# EAGLE design Tannenbaum (EAGLE 9.2.0)
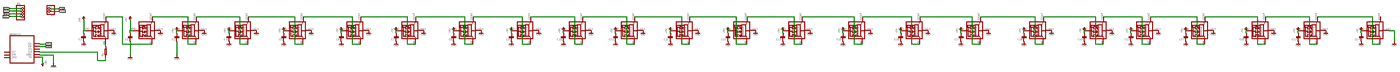
[diagram p0: schematic, sheet 1, overview]
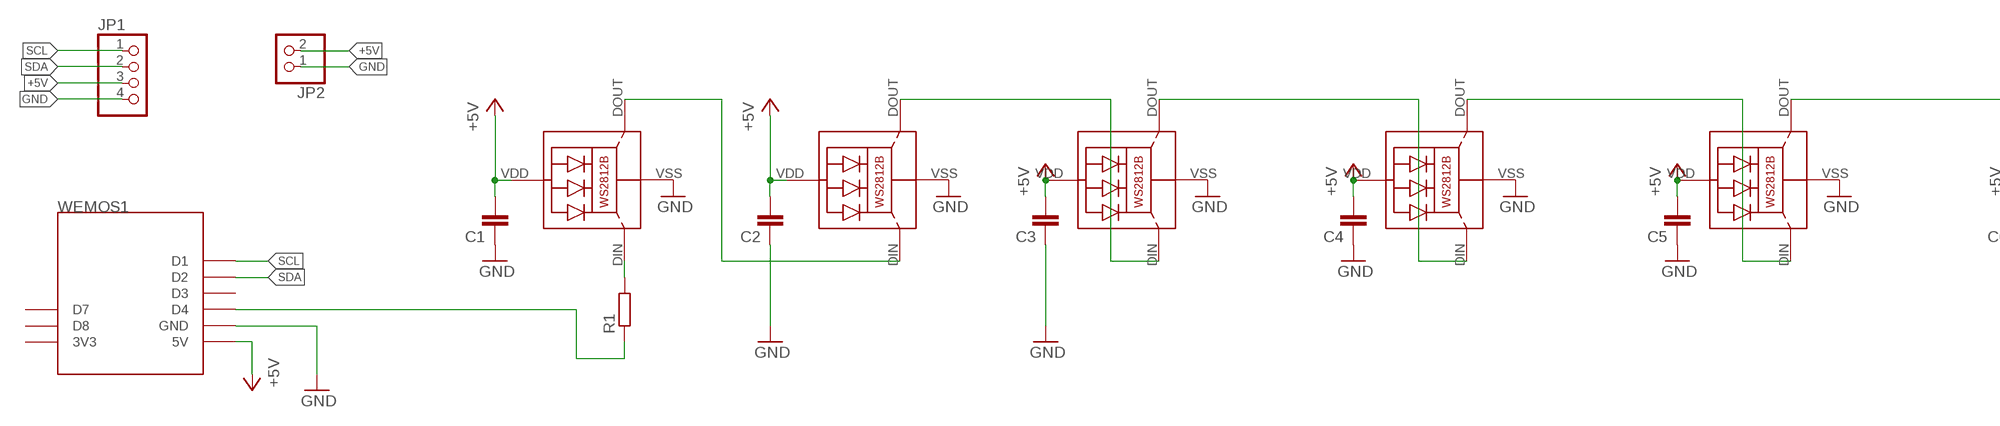
[diagram p1: schematic, sheet 1, part 1 of 4]
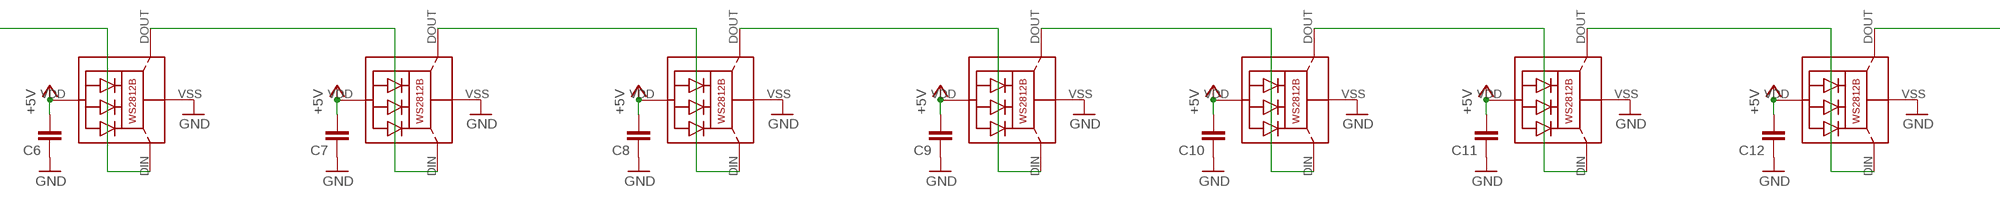
[diagram p2: schematic, sheet 1, part 2 of 4]
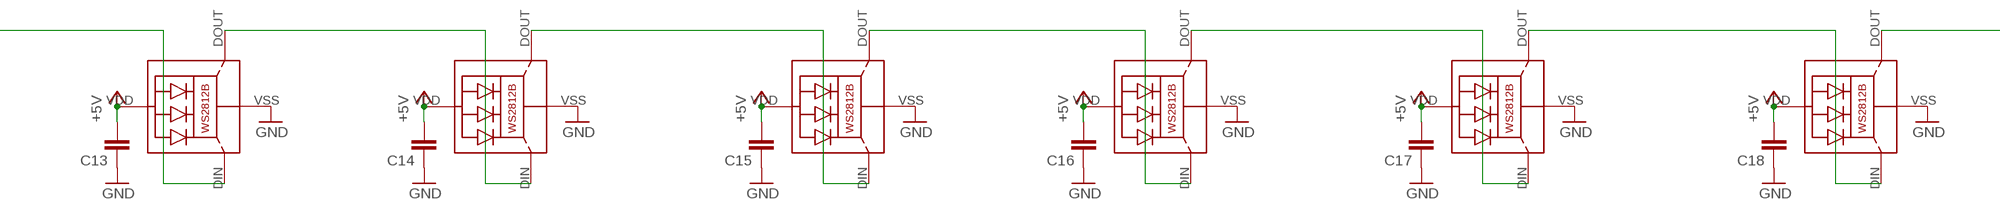
[diagram p3: schematic, sheet 1, part 3 of 4]
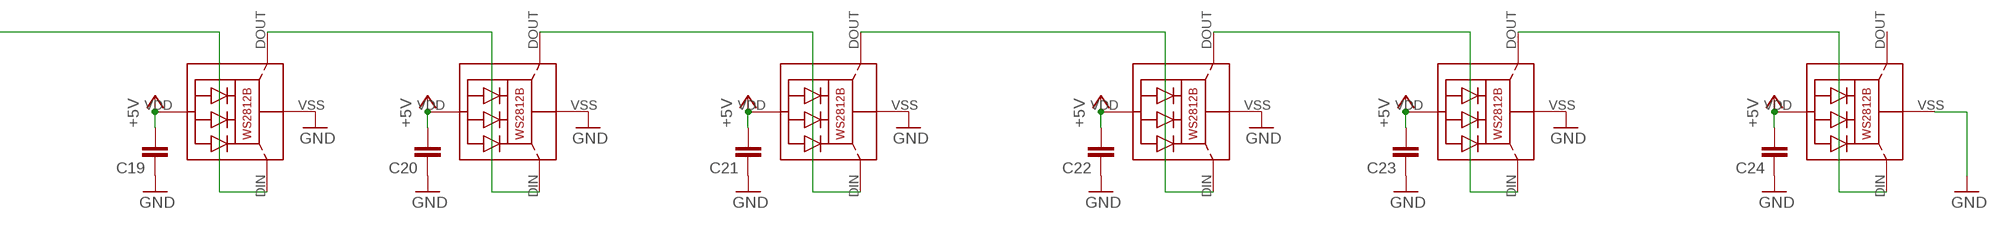
[diagram p4: schematic, sheet 1, part 4 of 4]

## Parts
C1  C-EUC0805  [C0805]
C2  C-EUC0805  [C0805]
C3  C-EUC0805  [C0805]
C4  C-EUC0805  [C0805]
C5  C-EUC0805  [C0805]
C6  C-EUC0805  [C0805]
C7  C-EUC0805  [C0805]
C8  C-EUC0805  [C0805]
C9  C-EUC0805  [C0805]
C10  C-EUC0805  [C0805]
C11  C-EUC0805  [C0805]
C12  C-EUC0805  [C0805]
C13  C-EUC0805  [C0805]
C14  C-EUC0805  [C0805]
C15  C-EUC0805  [C0805]
C16  C-EUC0805  [C0805]
C17  C-EUC0805  [C0805]
C18  C-EUC0805  [C0805]
C19  C-EUC0805  [C0805]
C20  C-EUC0805  [C0805]
C21  C-EUC0805  [C0805]
C22  C-EUC0805  [C0805]
C23  C-EUC0805  [C0805]
C24  C-EUC0805  [C0805]
JP1  PINHD-1X4  [1X04]
JP2  PINHD-1X2  [1X02]
LED1  WS2812B  [WS2812B]
LED2  WS2812B  [WS2812B]
LED3  WS2812B  [WS2812B]
LED4  WS2812B  [WS2812B]
LED5  WS2812B  [WS2812B]
LED6  WS2812B  [WS2812B]
LED7  WS2812B  [WS2812B]
LED8  WS2812B  [WS2812B]
LED9  WS2812B  [WS2812B]
LED10  WS2812B  [WS2812B]
LED11  WS2812B  [WS2812B]
LED12  WS2812B  [WS2812B]
LED13  WS2812B  [WS2812B]
LED14  WS2812B  [WS2812B]
LED15  WS2812B  [WS2812B]
LED16  WS2812B  [WS2812B]
LED17  WS2812B  [WS2812B]
LED18  WS2812B  [WS2812B]
LED19  WS2812B  [WS2812B]
LED20  WS2812B  [WS2812B]
LED21  WS2812B  [WS2812B]
LED22  WS2812B  [WS2812B]
LED23  WS2812B  [WS2812B]
LED24  WS2812B  [WS2812B]
R1  R-EU_R0805  [R0805]
WEMOS1  WEMOS-D1-MINI1  [WEMOS-D1-MINI1]

## Nets
+5V: C1.2 C2.2 C3.2 C4.2 C5.2 C6.2 C7.2 C8.2 C9.2 C10.2 C11.2 C12.2 C13.2 C14.2 C15.2 C16.2 C17.2 C18.2 C19.2 C20.2 C21.2 C22.2 C23.2 C24.2 JP1.3 JP2.2 LED1.VDD LED2.VDD LED3.VDD LED4.VDD LED5.VDD LED6.VDD LED7.VDD LED8.VDD LED9.VDD LED10.VDD LED11.VDD LED12.VDD LED13.VDD LED14.VDD LED15.VDD LED16.VDD LED17.VDD LED18.VDD LED19.VDD LED20.VDD LED21.VDD LED22.VDD LED23.VDD LED24.VDD WEMOS1.5V
GND: C1.1 C2.1 C3.1 C4.1 C5.1 C6.1 C7.1 C8.1 C9.1 C10.1 C11.1 C12.1 C13.1 C14.1 C15.1 C16.1 C17.1 C18.1 C19.1 C20.1 C21.1 C22.1 C23.1 C24.1 JP1.4 JP2.1 LED1.VSS(GND) LED2.VSS(GND) LED3.VSS(GND) LED4.VSS(GND) LED5.VSS(GND) LED6.VSS(GND) LED7.VSS(GND) LED8.VSS(GND) LED9.VSS(GND) LED10.VSS(GND) LED11.VSS(GND) LED12.VSS(GND) LED13.VSS(GND) LED14.VSS(GND) LED15.VSS(GND) LED16.VSS(GND) LED17.VSS(GND) LED18.VSS(GND) LED19.VSS(GND) LED20.VSS(GND) LED21.VSS(GND) LED22.VSS(GND) LED23.VSS(GND) LED24.VSS(GND) WEMOS1.GND
N$19: LED1.DIN(DI) R1.2
N$25: R1.1 WEMOS1.D4
N$27: LED1.DOUT(DO) LED2.DIN(DI)
N$28: LED2.DOUT(DO) LED3.DIN(DI)
N$29: LED3.DOUT(DO) LED4.DIN(DI)
N$30: LED4.DOUT(DO) LED5.DIN(DI)
N$31: LED5.DOUT(DO) LED6.DIN(DI)
N$32: LED6.DOUT(DO) LED7.DIN(DI)
N$33: LED7.DOUT(DO) LED8.DIN(DI)
N$34: LED8.DOUT(DO) LED9.DIN(DI)
N$35: LED9.DOUT(DO) LED10.DIN(DI)
N$36: LED10.DOUT(DO) LED11.DIN(DI)
N$37: LED11.DOUT(DO) LED12.DIN(DI)
N$38: LED12.DOUT(DO) LED13.DIN(DI)
N$39: LED13.DOUT(DO) LED14.DIN(DI)
N$40: LED14.DOUT(DO) LED15.DIN(DI)
N$41: LED15.DOUT(DO) LED16.DIN(DI)
N$42: LED16.DOUT(DO) LED17.DIN(DI)
N$43: LED17.DOUT(DO) LED18.DIN(DI)
N$44: LED18.DOUT(DO) LED19.DIN(DI)
N$45: LED19.DOUT(DO) LED20.DIN(DI)
N$46: LED20.DOUT(DO) LED21.DIN(DI)
N$47: LED21.DOUT(DO) LED22.DIN(DI)
N$48: LED22.DOUT(DO) LED23.DIN(DI)
N$49: LED23.DOUT(DO) LED24.DIN(DI)
SCL: JP1.1 WEMOS1.D1
SDA: JP1.2 WEMOS1.D2
Unconnected: LED24.DOUT(DO) WEMOS1.3V3 WEMOS1.D3 WEMOS1.D7 WEMOS1.D8

## Library data of the parts
C1-C24 = rcl:C-EU: CAPACITOR, European symbol; SPICEPREFIX: C
JP1 = pinhead:PINHD-1X4: PIN HEADER
JP2 = pinhead:PINHD-1X2: PIN HEADER
LED1-LED24 = WS2812B:WS2812B: Features and Benefits  * Intelligent reverse connect protection, the power supply reverse connection does not damage the IC. * The control circuit and the LED share the only power source. Control circuit and RGB chip are integrated in a package of 5050 components, form a complete control of pixel point.  * Built-in signal reshaping circuit, after wave reshaping to the next driver, ensure wave-form distortion not accumulate.  * Built-in electric reset circuit and power lost reset circuit.  * Each pixel of the three primary color can achieve 256 brightness display, completed 16777216 color full color display, and scan frequency not less than 400Hz/s.  * Cascading port transmission signal by single line.  * Any two point the distance more than 5m transmission signal without any increase circuit.  * When the refresh rate is 30fps, cascade number are not less than1024 points.  * Send data at speeds of 800Kbps.  *The color of the light were highly consistent, cost-effective. Applications  Full-color module, Full color soft lights a lamp strip. LED decorative lighting, Indoor/outdoor LED video irregular screen. General description WS2812B is a intelligent control LED light source that the control circuit and RGB chip are integrated in a package of 5050 components. It internal include intelligent digital port data latch and signal reshaping amplification drive circuit. Also include a precision internal oscillator and a 12V voltage programmable constant curre-nt control part, effectively ensuring the pixel point light color height consistent. The data transfer protocol use single NZR communication mode. After the pixel power-on reset, the DIN port receive data from controller, the first pixel collect initial 24bit data then sent to the internal data latch, the other data which reshaping by the internal signal reshaping amplification circuit sent to the next cascade pixel through the DO port. After transmission for each pixel,the signal to reduce 24bit. pixel adopt auto reshaping transmit technology, making the pixel cascade number is not limited the signal transmission, only depend on the speed of signal transmission. LED with low driving voltage, environmental protection and energy saving, high brightness, scattering angle is large, good consistency, low power, long life and other advantages. The control chip integrated in LED above becoming more simple circuit, small volume, convenient installation. Absolute Maximum Ratings Power supply voltage: VDD +3.5V..+5.3V Input voltage: VI -0.5V..VDD+0.5V based on WS2812 from https://github.com/adafruit/Adafruit-Eagle-Library
R1 = rcl:R-EU_: RESISTOR, European symbol; SPICEPREFIX: R
WEMOS1 = esp8266modules:WEMOS-D1-MINI1: WeMos.cc D1 mini ESP8266 module; SPICEPREFIX: X

## Board
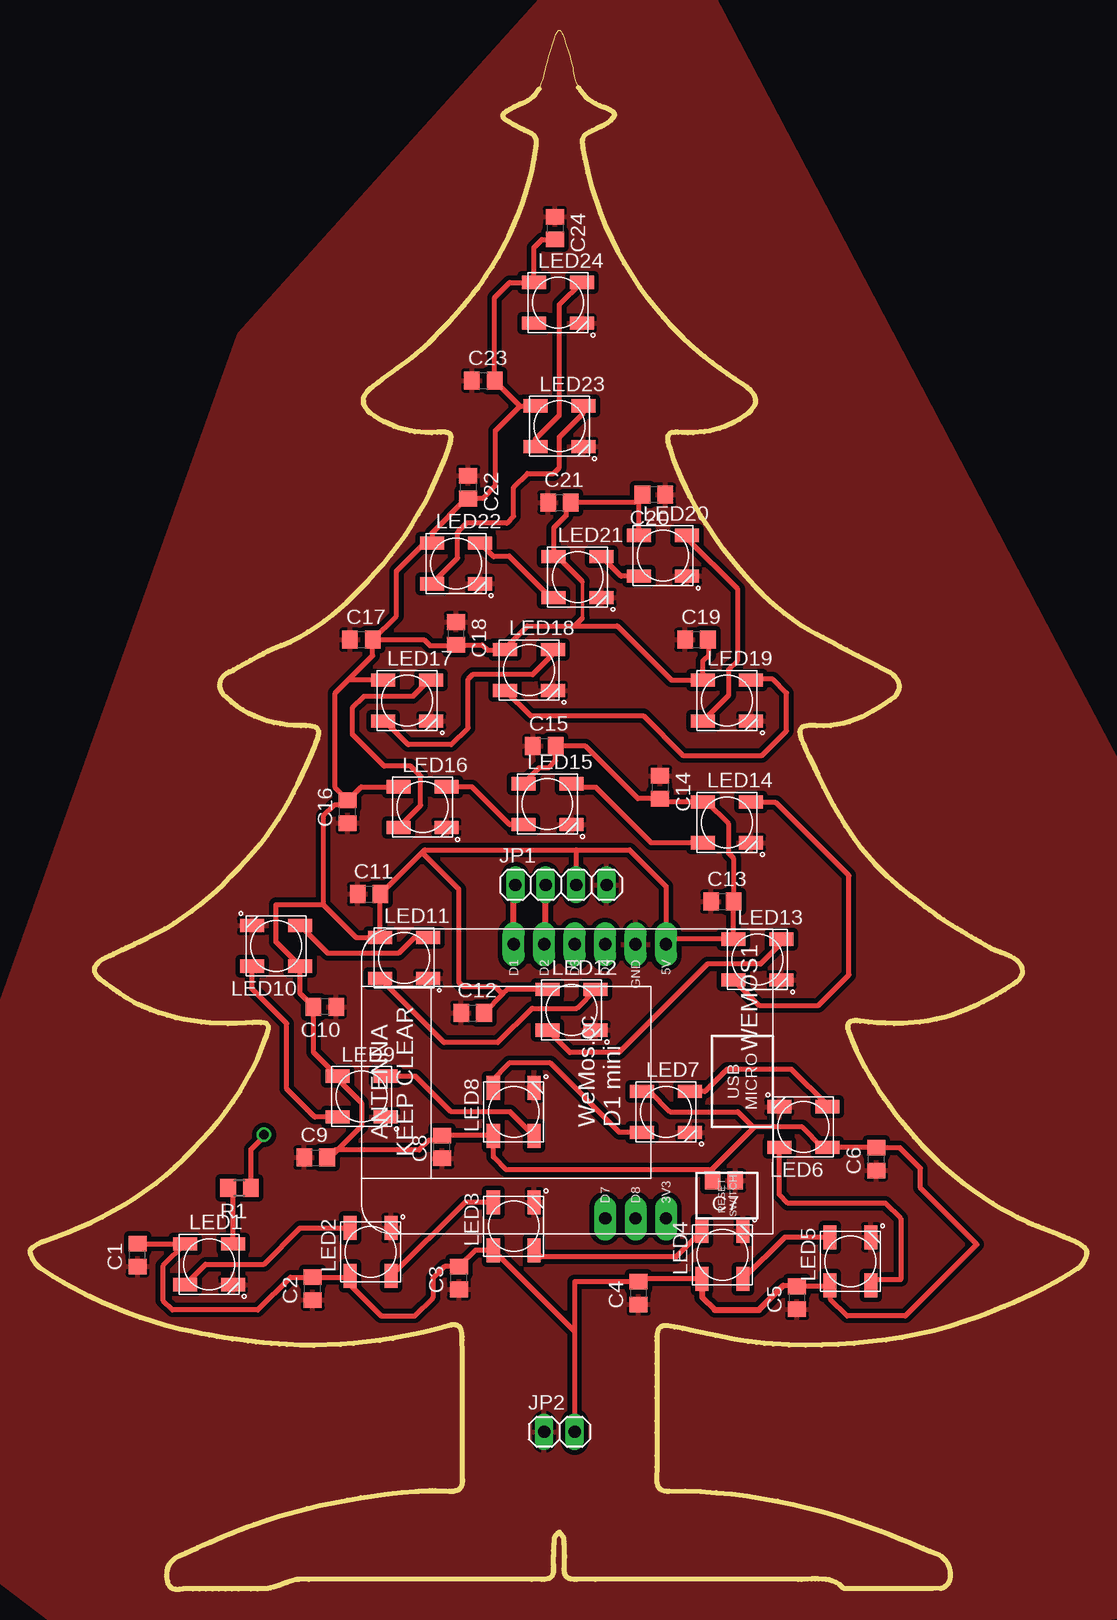
[diagram p5: board, top side]
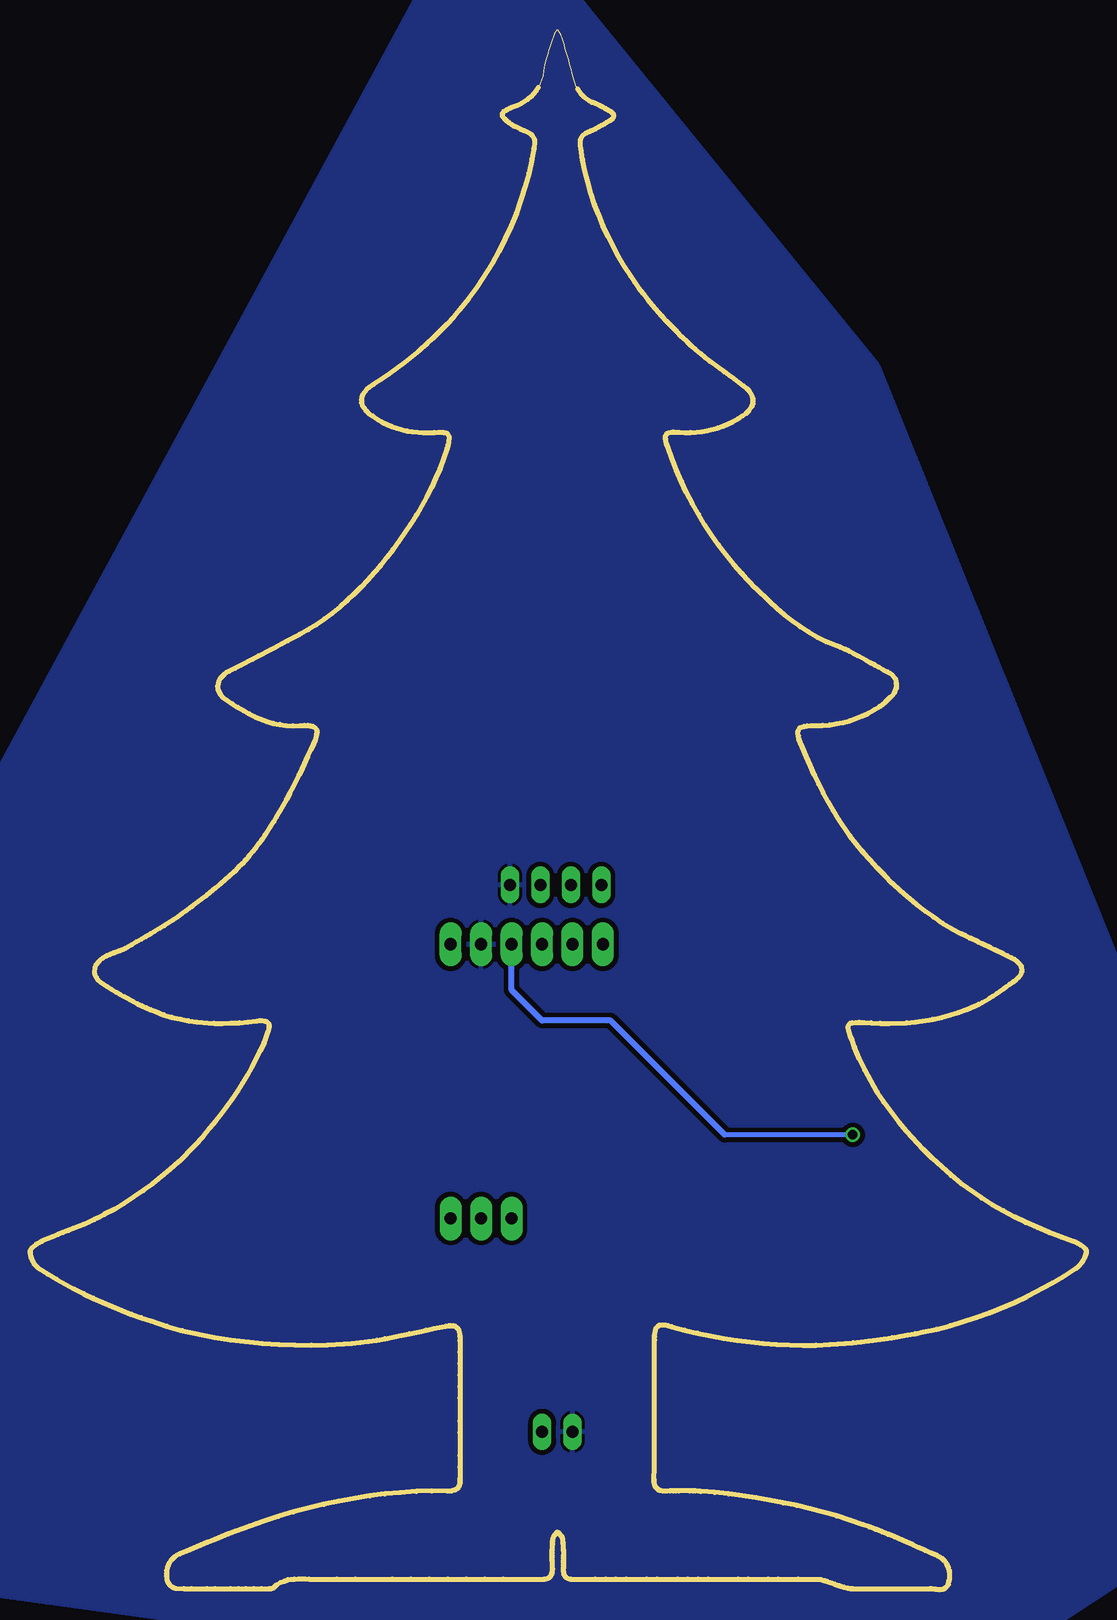
[diagram p6: board, bottom side, seen from below]

Size 88.1 x 130 mm. Coordinates in mm from the lower left corner, seen from the top.
Outline: 19.35,45.23 19.56,45.76 19.71,46.15 19.8,46.45 19.88,46.74 19.89,46.94 19.81,47.07 19.73,47.19 19.55,47.25 19.25,47.27 18.96,47.28 18.54,47.26 17.99,47.23 17.24,47.19 16.49,47.18 15.01,47.24 14.28,47.31 12.83,47.53 12.11,47.68 11.41,47.88 10.7,48.09 10,48.34 9.32,48.64 9.01,48.78 8.71,48.94 8.11,49.28 7.82,49.46 7.54,49.65 7.25,49.85 6.97,50.05 6.69,50.25 6.42,50.46 6.14,50.67 5.87,50.87 5.68,51.02 5.55,51.18 5.47,51.33 5.4,51.48 5.38,51.64 5.41,51.79 5.45,51.95 5.54,52.1 5.69,52.24 5.83,52.39 6.03,52.52 6.28,52.65 6.62,52.82 6.97,52.99 7.66,53.32 8.01,53.49 8.71,53.81 9.06,53.98 9.75,54.31 10.1,54.48 10.44,54.66 11.25,55.07 12.02,55.54 12.75,56.04 13.49,56.55 14.19,57.09 15.54,58.25 16.19,58.86 16.81,59.5 17.44,60.14 18.05,60.8 18.65,61.49 19.22,62.14 19.74,62.82 20.7,64.21 21.14,64.93 21.55,65.66 21.96,66.39 22.34,67.14 22.69,67.91 23.05,68.67 23.39,69.44 23.71,70.23 23.87,70.61 23.98,70.91 24.03,71.15 24.09,71.39 24.08,71.56 23.92,71.81 23.77,71.89 23.54,71.94 23.31,71.99 23,72.01 22.6,72.02 22,72.03 21.43,72.08 20.87,72.17 20.31,72.27 19.77,72.41 18.73,72.79 18.23,73.03 17.74,73.33 17.26,73.62 16.8,73.97 16.35,74.38 16.16,74.56 16.03,74.75 15.86,75.14 15.83,75.34 15.85,75.53 15.87,75.72 15.95,75.9 16.2,76.23 16.38,76.37 16.6,76.48 16.96,76.66 17.32,76.86 17.68,77.05 18.04,77.25 18.39,77.45 19.1,77.84 19.46,78.03 19.82,78.21 20.19,78.39 20.56,78.56 20.93,78.7 21.73,79.02 22.48,79.39 23.18,79.82 23.89,80.25 24.56,80.73 25.19,81.25 25.83,81.77 26.43,82.32 27.61,83.48 28.17,84.08 28.73,84.69 29.43,85.46 30.08,86.25 30.69,87.08 31.29,87.9 31.85,88.76 32.37,89.64 32.88,90.52 33.35,91.43 33.78,92.36 34.21,93.29 34.59,94.25 34.92,95.24 35.02,95.52 35.08,95.74 35.1,95.91 35.12,96.09 35.1,96.21 35.03,96.3 34.95,96.39 34.83,96.44 34.66,96.46 34.48,96.48 34.25,96.48 33.96,96.46 33.48,96.43 33.01,96.44 32.1,96.52 31.65,96.6 30.77,96.82 30.34,96.97 29.5,97.35 29.09,97.57 28.69,97.84 28.41,98.03 28.19,98.23 27.9,98.63 27.82,98.84 27.82,99.05 27.81,99.26 27.87,99.47 28.14,99.9 28.34,100.11 28.61,100.32 29.01,100.62 29.41,100.92 29.81,101.21 30.22,101.5 30.62,101.79 31.42,102.39 31.82,102.69 32.2,103 32.58,103.32 32.95,103.64 33.3,103.99 33.73,104.41 34.16,104.84 34.57,105.27 34.99,105.71 35.4,106.15 36.2,107.06 36.58,107.53 36.95,108 37.32,108.48 37.67,108.96 38,109.46 38.53,110.27 39.03,111.1 39.92,112.8 40.32,113.67 40.68,114.56 41.03,115.46 41.33,116.37 41.58,117.3 41.84,118.24 42.04,119.19 42.18,120.16 42.21,120.33 42.22,120.48 42.21,120.62 42.21,120.76 42.19,120.88 42.1,121.09 42.03,121.19 41.83,121.36 41.7,121.44 41.53,121.5 41.38,121.57 41.23,121.64 40.93,121.78 40.78,121.86 40.63,121.94 40.48,122.02 40.33,122.1 40.19,122.19 40.04,122.27 39.9,122.36 39.76,122.44 39.65,122.51 39.56,122.57 39.51,122.64 39.46,122.71 39.43,122.78 39.43,122.85 39.43,122.92 39.46,122.99 39.52,123.05 39.58,123.12 39.67,123.19 39.79,123.25 39.88,123.3 39.98,123.36 40.07,123.41 40.17,123.47 40.26,123.52 40.36,123.58 40.46,123.63 40.55,123.68 40.65,123.73 40.75,123.78 40.85,123.82 40.95,123.85 41.25,123.96 41.51,124.11 41.95,124.45 42.14,124.64 42.29,124.86 42.44,125.08 42.56,125.33 42.66,125.59 42.77,125.85 42.85,126.13 42.91,126.42 42.97,126.68 43.04,126.94 43.11,127.2 43.18,127.46 43.25,127.72 43.32,127.98 43.4,128.24 43.48,128.49 43.55,128.75 43.63,129.01 43.71,129.27 43.83,129.62 43.98,129.86 44.06,129.96 44.19,130 44.26,129.89 44.35,129.75 44.43,129.6 44.51,129.37 44.54,129.26 44.62,129.02 44.78,128.54 44.86,128.3 44.93,128.06 45.01,127.82 45.08,127.58 45.2,127.09 45.25,126.85 45.29,126.6 45.35,126.2 45.44,125.85 45.58,125.53 45.72,125.21 45.9,124.93 46.11,124.69 46.33,124.44 46.58,124.23 47.16,123.86 47.49,123.71 47.85,123.58 47.91,123.56 47.97,123.53 48.04,123.5 48.1,123.48 48.16,123.45 48.22,123.41 48.27,123.38 48.33,123.35 48.45,123.28 48.51,123.25 48.57,123.21 48.61,123.18 48.65,123.14 48.7,123.05 48.72,123 48.72,122.95 48.73,122.9 48.72,122.85 48.68,122.75 48.64,122.71 48.6,122.67 48.58,122.64 48.49,122.55 48.42,122.48 48.34,122.41 48.26,122.34 48.16,122.26 47.93,122.11 47.81,122.04 47.68,121.97 47.23,121.77 46.89,121.62 46.64,121.48 46.39,121.34 46.23,121.22 46.05,120.89 46.03,120.69 46.09,120.12 46.16,119.75 46.27,119.25 46.51,118.08 46.82,116.94 47.56,114.73 47.99,113.65 48.49,112.61 48.99,111.56 49.56,110.55 50.82,108.57 51.52,107.61 52.28,106.68 52.79,106.06 53.33,105.47 54.45,104.34 55.04,103.8 55.64,103.29 56.24,102.78 56.86,102.29 57.5,101.82 58.13,101.35 58.79,100.9 59.45,100.46 59.78,100.24 60.03,100.03 60.36,99.59 60.45,99.37 60.46,99.15 60.47,98.93 60.4,98.71 60.24,98.48 60.09,98.26 59.85,98.04 59.53,97.82 59.15,97.55 58.75,97.32 57.93,96.95 57.51,96.8 56.65,96.58 56.21,96.51 55.31,96.43 54.85,96.43 54.38,96.46 54.06,96.48 53.81,96.48 53.62,96.45 53.44,96.42 53.31,96.36 53.17,96.16 53.15,96.02 53.19,95.65 53.25,95.41 53.34,95.11 53.61,94.27 53.92,93.45 54.27,92.65 54.63,91.85 55.02,91.08 55.87,89.57 56.34,88.83 57.31,87.4 57.83,86.7 58.37,86.01 58.88,85.37 59.4,84.75 59.95,84.15 60.49,83.55 61.06,82.98 61.66,82.44 62.26,81.89 62.89,81.38 63.55,80.91 64.21,80.43 64.9,80 65.63,79.61 66.12,79.36 66.61,79.1 67.09,78.84 67.58,78.58 68.06,78.33 69.04,77.81 69.53,77.56 70.5,77.05 70.99,76.8 71.49,76.56 71.71,76.44 71.92,76.29 72.08,76.11 72.25,75.93 72.37,75.73 72.47,75.3 72.45,75.07 72.23,74.6 72.02,74.37 71.7,74.14 71.24,73.82 70.77,73.52 70.3,73.25 69.82,72.98 69.33,72.74 68.33,72.35 67.81,72.2 67.27,72.11 66.73,72.02 66.17,71.98 65.58,72.02 65.23,72.04 64.95,72.03 64.74,72 64.52,71.96 64.37,71.89 64.2,71.66 64.18,71.5 64.21,71.3 64.24,71.09 64.33,70.83 64.47,70.51 64.7,69.99 64.93,69.47 65.42,68.43 65.67,67.91 66.18,66.89 66.44,66.38 66.72,65.87 66.99,65.37 67.27,64.87 67.56,64.38 67.79,64.01 68.02,63.63 68.5,62.9 68.76,62.54 69.02,62.18 69.29,61.83 69.56,61.49 69.85,61.15 70.13,60.82 70.43,60.5 70.73,60.19 71.09,59.83 71.46,59.48 71.83,59.15 72.21,58.81 72.6,58.49 73.39,57.85 73.79,57.54 74.6,56.93 75.01,56.64 75.42,56.34 75.78,56.08 76.15,55.83 76.9,55.35 77.28,55.11 77.67,54.88 78.05,54.65 78.44,54.43 78.82,54.21 79.21,53.98 79.6,53.76 79.99,53.54 80.12,53.46 80.26,53.39 80.41,53.33 80.56,53.27 80.71,53.21 80.86,53.16 81.01,53.1 81.16,53.05 81.31,52.99 81.45,52.93 81.6,52.87 81.74,52.8 82.03,52.64 82.26,52.46 82.43,52.27 82.59,52.08 82.69,51.87 82.73,51.45 82.68,51.24 82.56,51.03 82.44,50.83 82.24,50.63 81.97,50.45 81.62,50.24 81.28,50.02 80.92,49.81 80.57,49.6 80.21,49.4 79.49,49.02 79.12,48.83 78.75,48.66 78.38,48.49 78.01,48.33 77.63,48.18 76.95,47.91 76.27,47.71 75.57,47.56 74.88,47.4 74.18,47.3 72.77,47.2 72.06,47.18 71.35,47.21 70.63,47.24 69.92,47.3 69.2,47.39 68.96,47.42 68.76,47.42 68.46,47.37 68.34,47.32 68.2,47.15 68.17,47.03 68.18,46.88 68.18,46.74 68.23,46.55 68.32,46.34 68.6,45.61 68.91,44.91 69.61,43.54 69.98,42.87 70.38,42.21 70.79,41.56 71.22,40.93 71.67,40.3 72.12,39.68 72.6,39.07 73.1,38.47 73.72,37.72 74.37,37.01 75.72,35.66 76.42,35.02 77.89,33.82 78.65,33.25 80.23,32.2 81.05,31.7 81.9,31.25 82.31,31.03 82.73,30.83 83.16,30.65 83.59,30.46 84.03,30.28 84.46,30.11 84.9,29.93 85.34,29.76 85.77,29.59 86.21,29.41 86.64,29.23 87.07,29.04 87.18,29 87.29,28.94 87.52,28.8 87.64,28.72 87.85,28.56 87.93,28.47 88.06,28.3 88.1,28.22 88.1,28.15 88.1,28.03 88.08,27.9 88,27.64 87.95,27.5 87.88,27.38 87.81,27.25 87.73,27.13 87.64,27.02 87.56,26.92 87.46,26.83 87.36,26.77 86.63,26.3 85.89,25.86 84.37,25.04 83.6,24.65 82.82,24.29 82.04,23.92 81.25,23.59 79.64,22.95 78.83,22.66 78,22.38 76.69,21.94 75.38,21.58 72.72,21.01 71.39,20.8 68.71,20.5 67.36,20.42 66.01,20.39 64.66,20.37 63.3,20.4 61.94,20.47 61.25,20.51 60.57,20.59 59.88,20.69 59.2,20.79 58.51,20.91 57.15,21.18 56.46,21.33 55.1,21.62 54.42,21.76 53.74,21.89 53.44,21.95 53.19,21.98 53,21.98 52.81,21.98 52.66,21.95 52.55,21.87 52.44,21.79 52.37,21.66 52.33,21.48 52.28,21.3 52.26,21.07 52.26,20.76 52.26,19.8 52.26,18.85 52.26,17.89 52.26,16.93 52.26,15.97 52.26,14.06 52.26,13.1 52.26,11.18 52.25,10.23 52.25,9.27 52.25,9.08 52.26,8.91 52.33,8.64 52.39,8.53 52.55,8.36 52.65,8.29 52.93,8.21 53.09,8.2 53.29,8.2 54.61,8.22 55.91,8.17 57.21,8.07 58.5,7.96 59.79,7.8 62.34,7.37 63.61,7.1 66.13,6.46 67.38,6.1 68.62,5.69 69.21,5.5 69.8,5.29 70.97,4.86 71.56,4.63 72.72,4.16 73.3,3.93 73.87,3.69 74.45,3.45 75.03,3.21 75.61,2.97 75.83,2.87 76.03,2.74 76.19,2.58 76.35,2.42 76.48,2.22 76.66,1.8 76.71,1.58 76.72,1.34 76.72,1.1 76.69,0.86 76.61,0.62 76.59,0.56 76.55,0.5 76.5,0.44 76.46,0.38 76.39,0.32 76.33,0.27 76.26,0.22 76.19,0.17 76.12,0.14 76.05,0.11 75.98,0.09 75.92,0.09 75.27,0.08 74.62,0.08 73.33,0.07 72.68,0.07 71.39,0.06 70.74,0.07 70.1,0.07 69.45,0.07 68.8,0.07 68.16,0.07 68.12,0.07 68.09,0.07 68.05,0.07 68.02,0.07 67.98,0.08 67.94,0.08 67.91,0.09 67.88,0.1 67.85,0.11 67.82,0.12 67.79,0.13 67.77,0.15 67.5,0.42 67.21,0.59 66.9,0.71 66.6,0.82 66.37,0.85 66.05,0.87 65.73,0.89 65.48,0.89 65.15,0.88 64.83,0.86 64.35,0.85 64.03,0.85 62.5,0.86 60.96,0.86 57.89,0.87 56.35,0.87 54.81,0.87 53.27,0.87 51.74,0.87 50.2,0.86 48.66,0.86 47.13,0.85 45.59,0.84 45.38,0.84 45.21,0.86 45.07,0.89 44.94,0.93 44.83,0.99 44.75,1.07 44.66,1.15 44.61,1.26 44.58,1.39 44.55,1.53 44.54,1.69 44.54,1.88 44.55,2.07 44.56,2.27 44.56,2.46 44.56,2.65 44.56,2.84 44.56,3.04 44.56,3.23 44.55,3.42 44.55,3.62 44.54,3.81 44.53,4 44.51,4.19 44.51,4.25 44.49,4.3 44.44,4.4 44.4,4.46 44.36,4.51 44.32,4.56 44.28,4.61 44.2,4.71 44.16,4.76 44.12,4.81 44.09,4.77 44.04,4.72 44,4.67 43.95,4.63 43.91,4.58 43.87,4.53 43.82,4.49 43.79,4.44 43.73,4.34 43.71,4.3 43.71,4.25 43.69,4.05 43.67,3.85 43.66,3.64 43.65,3.44 43.64,3.24 43.63,2.84 43.62,2.64 43.62,2.44 43.62,2.24 43.63,2.03 43.64,1.83 43.64,1.65 43.64,1.5 43.61,1.37 43.58,1.24 43.53,1.14 43.39,0.98 43.29,0.93 43.03,0.86 42.87,0.84 42.67,0.84 41.82,0.85 40.96,0.86 40.1,0.86 39.25,0.87 38.39,0.87 36.68,0.87 35.82,0.87 34.11,0.86 33.25,0.86 32.39,0.86 31.56,0.86 29.07,0.87 28.23,0.87 26.57,0.87 25.74,0.87 24.08,0.86 23.25,0.85 22.41,0.84 22.27,0.84 22.14,0.82 21.86,0.75 21.72,0.7 21.58,0.65 21.44,0.6 21.31,0.55 21.03,0.44 20.89,0.39 20.75,0.35 20.65,0.32 20.54,0.29 20.44,0.26 20.34,0.23 20.23,0.2 20.03,0.14 19.92,0.12 19.82,0.1 19.71,0.08 19.61,0.07 19.51,0.07 18.97,0.06 18.43,0.06 17.36,0.05 16.82,0.04 16.28,0.04 15.74,0.04 15.21,0.05 14.67,0.05 14.13,0.05 13.59,0.06 13.06,0.07 12.92,0.08 12.76,0.05 12.6,0.03 12.45,0.02 12.29,0 12.14,0.01 11.99,0.03 11.85,0.07 11.74,0.17 11.63,0.27 11.54,0.43 11.48,0.68 11.43,0.91 11.42,1.14 11.43,1.35 11.45,1.56 11.5,1.77 11.66,2.13 11.77,2.3 11.92,2.44 12.06,2.58 12.24,2.71 12.45,2.8 12.96,3.03 13.47,3.27 13.98,3.5 14.49,3.72 15,3.95 16.04,4.39 16.56,4.6 17.08,4.81 17.6,5.01 18.12,5.21 18.65,5.4 19.74,5.78 20.84,6.13 23.06,6.74 24.18,7 25.31,7.23 26.44,7.46 27.58,7.65 29.86,7.96 31.01,8.08 32.16,8.18 32.4,8.2 32.63,8.21 32.86,8.22 33.1,8.23 33.33,8.23 33.56,8.23 33.79,8.23 34.03,8.23 34.26,8.22 34.49,8.22 34.73,8.21 34.96,8.2 35.15,8.19 35.32,8.2 35.46,8.23 35.6,8.26 35.71,8.31 35.89,8.46 35.96,8.56 36,8.69 36.04,8.82 36.06,8.98 36.06,9.18 36.06,10.15 36.05,11.11 36.05,12.08 36.05,13.04 36.05,16.91 36.05,17.87 36.05,18.84 36.04,19.81 36.04,20.77 36.03,21.09 36.02,21.34 35.97,21.53 35.93,21.72 35.86,21.85 35.75,21.94 35.64,22.02 35.5,22.06 35.12,22.04 34.88,22 34.58,21.91 33.51,21.62 32.42,21.36 30.25,20.93 29.16,20.76 26.96,20.5 25.86,20.42 23.65,20.35 22.54,20.36 21.43,20.43 20.78,20.47 20.13,20.52 19.48,20.58 18.82,20.64 18.17,20.72 16.88,20.89 16.23,20.99 15.58,21.1 14.94,21.21 14.3,21.33 13.66,21.46 12.52,21.7 11.39,21.99 9.19,22.67 8.1,23.06 5.98,23.95 4.94,24.44 2.89,25.53 1.89,26.12 0.91,26.76 0.8,26.83 0.7,26.92 0.6,27.03 0.5,27.13 0.41,27.25 0.33,27.38 0.25,27.51 0.18,27.64 0.07,27.91 0.03,28.04 0.01,28.17 0,28.23 0.04,28.3 0.11,28.38 0.18,28.46 0.28,28.55 0.51,28.71 0.65,28.8 0.78,28.87 0.91,28.94 1.04,29 1.15,29.04 2.16,29.38 3.15,29.76 4.12,30.18 5.09,30.6 6.04,31.06 6.95,31.57 7.87,32.07 8.76,32.63 10.48,33.85 11.31,34.51 12.1,35.24 12.86,35.95 13.61,36.68 15.01,38.2 15.68,38.99 16.3,39.81 16.92,40.64 17.49,41.49 18.51,43.3 18.97,44.24 19.35,45.23
Copper layers (1*16): Top 0.035mm / dielectric 1.5mm / Bottom 0.035mm
Design rules "default *": minimum track width 6mil, minimum drill 0.35mm, track to track 0.4mm, track to pad 0.4mm, pad to pad 0.4mm, via to via 0.4mm, smd to smd 0.4mm, copper to edge 0mil, drill to drill 0.6mm, minimum pad ring 10mil, minimum via ring 8mil, stop-mask expansion 4mil, vias tented up to drill 0mil, thermal gap 10mil

### Footprints (pad centres in the part's own frame; a part is rotated, then mirrored left to right if it is on the bottom)
C0805 = smd 1.3 x 1.5: 1 -0.95,0; 2 0.95,0
1X04 = drill 1.016 long: 1 -3.81,0; 2 -1.27,0; 3 1.27,0; 4 3.81,0
1X02 = drill 1.016 long: 1 -1.27,0; 2 1.27,0
WS2812B = smd 2 x 1.1: DIN 2,1.7; DOUT -2,-1.7; VDD -2,1.7; VSS 2,-1.7
R0805 = smd 1.3 x 1.5: 1 -0.95,0; 2 0.95,0
WEMOS-D1-MINI1 = drill 1.016 pad 1.829 long: 3V3 -10.16,-10.16; 5V 12.7,-10.16; D1 12.7,2.54; D2 12.7,0; D3 12.7,-2.54; D4 12.7,-5.08; D7 -10.16,-5.08; D8 -10.16,-7.62; GND 12.7,-7.62

### Placement (x,y rotation side)
C1  8.96,27.88 90 top
C2  23.57,25.08 90 top
C3  35.76,25.97 90 top
C4  50.75,24.7 90 top
C5  63.95,24.32 90 top
C6  70.56,35.88 90 top
C7  57.86,34.1 180 top
C8  34.36,36.9 90 top
C9  23.82,36.01 0 top
C10  24.58,48.58 180 top
C11  28.27,57.98 0 top
C12  36.9,48.07 0 top
C13  57.73,57.34 0 top
C14  52.52,66.87 270 top
C15  42.87,70.3 0 top
C16  26.49,64.84 90 top
C17  27.63,79.19 0 top
C18  35.51,79.69 270 top
C19  55.57,79.19 0 top
C20  52.02,91.25 180 top
C21  44.14,90.62 0 top
C22  36.52,91.89 270 top
C23  37.79,100.78 0 top
C24  43.76,113.48 270 top
JP1  44.27,58.74 0 top
JP2  44.14,13.15 0 top
LED1  14.93,27.12 0 top
LED2  28.39,28.13 90 top
LED3  40.33,30.29 90 top
LED4  57.73,27.88 90 top
LED5  68.4,27.37 90 top
LED6  64.46,38.55 180 top
LED7  53.03,39.82 0 top
LED8  40.33,39.82 90 top
LED9  27.63,41.09 0 top
LED10  20.52,53.66 180 top
LED11  31.19,52.64 0 top
LED12  45.16,48.33 0 top
LED13  60.65,52.52 0 top
LED14  58.11,63.95 0 top
LED15  43.13,65.47 0 top
LED16  32.71,65.22 0 top
LED17  31.44,74.11 0 top
LED18  41.6,76.65 0 top
LED19  58.11,74.11 0 top
LED20  52.78,86.17 0 top
LED21  45.67,84.39 0 top
LED22  35.51,85.54 0 top
LED23  44.14,96.97 0 top
LED24  44.01,107.25 0 top
R1  17.47,33.47 180 top
WEMOS1  42.87,41.09 90 top

### Tracks (layer width: path | path; a pad name or v marks a point on that pad's centre or on a via)
+5V
  Top 0.305: 46.05,84.01 46.05,80.96
  Top 0.406: C1.2 LED1.VDD 11.08,26.96 11.08,24.11 11.88,23.31 19,23.31 21.72,26.03 C2.2 26.6,26.03 LED2.VDD 26.69,25.39 29.28,22.8 32.08,22.8 33.6,24.32 33.6,25.97 34.55,26.92 C3.2 37.13,28.29 LED3.VDD 45.41,21.51 | 45.41,21.51 45.41,25.65 C4.2 50.97,25.88 LED4.VDD | 45.41,21.51 JP2.2 | 62.81,25.34 63.89,25.34 C5.2 66.6,25.27 LED5.VDD 66.7,24.24 68.14,22.8 72.97,22.8 78.94,28.77 74.24,33.47 74.24,35.12 72.53,36.83 C6.2 70.54,36.85 LED6.VDD 66.08,36.85 64.38,38.55 60.4,38.55 | 60.4,38.55 60.27,38.55 59,39.82 53.37,39.82 51.67,41.52 LED7.VDD | 60.4,38.55 56.91,35.06 C7.2 56.91,34.86 56.78,34.99 39.7,34.99 38.63,36.06 LED8.VDD 38.6,37.85 C8.2 33.97,37.45 33.26,37.45 32.45,36.64 25.41,36.64 C9.2 25.01,36.01 27.63,38.63 27.63,40.58 25.63,42.58 LED9.VDD 23.63,44.78 C10.2 22.52,49.69 LED10.VDD 20.52,53.96 20.52,57.09 24.46,57.09 | 58.6,54.17 LED13.VDD | LED13.VDD 58.65,57.31 C13.2 58.68,60.92 58.26,61.34 58.26,63.8 56.41,65.65 LED14.VDD 52.79,65.65 C14.2 50.68,65.92 46.3,70.3 C15.2 43.82,69.09 43.25,68.52 42.47,68.52 LED15.VDD | 24.46,57.09 27.2,54.34 LED11.VDD 29.19,57.95 C11.2 32.68,61.44 | C16.2 26.09,65.39 25.38,65.39 24.46,64.46 24.46,57.09 | C16.2 27.62,66.92 LED16.VDD | C17.2 28.58,77.85 26.54,75.81 | C16.2 25.44,66.83 25.44,74.71 26.54,75.81 | LED17.VDD 26.54,75.81 | C17.2 32.84,79.19 33.35,78.68 35.44,78.68 C18.2 37.73,78.74 38.17,78.3 39.55,78.3 LED18.VDD 39.6,78.46 41.47,80.33 45.41,80.33 | 50.73,87.82 LED20.VDD 50.78,90.96 C20.2 | C19.2 56.59,79.12 56.59,77.92 56.11,77.44 LED19.VDD 53.49,75.81 48.97,80.33 45.41,80.33 | C20.2 50.43,90.62 C21.2 44.7,90.22 44.7,89.51 43.67,88.48 LED21.VDD 43.97,86.09 46.05,84.01
  Top 0.406: 45.41,80.33 46.05,80.96 | C17.2 30.55,81.16 30.55,84.9 32.89,87.24 LED22.VDD 33.51,88.08 36.37,90.94 C22.2 36.58,91 37.79,91 38.81,92.01 38.81,96.62 40.85,98.67 | 40.85,98.67 C23.2 38.74,107.7 40,108.95 LED24.VDD 42.01,111.86 42.68,112.53 C24.2 43.32,112.53 | 39.41,49.63 39.81,50.03 LED12.VDD | 39.41,49.63 C12.2 | LED13.VDD 53.46,54.22 WEMOS1.5V 53.03,58.61 49.98,61.66 45.54,61.66 | 45.54,61.66 JP1.3 | 32.68,61.44 32.9,61.66 45.54,61.66 | 39.41,49.63 38.81,50.23 36.14,50.23 35.76,50.61 35.76,58.36 32.68,61.44 | C20.2 51.13,91.31 | 40.85,98.67 LED23.VDD
  Top 0.508: LED4.VDD 56.03,24.37 57.1,23.31 60.78,23.31 62.81,25.34
GND
  pour Bottom: -18.09,10.61 14.93,-10.98 125.42,4.26 50.49,142.69 17.47,102.05 -19.36,10.61
  pour Top: -15.55,11.88 17.47,104.59 51.76,142.69 125.42,2.99 16.2,-13.52 -15.55,10.61
N$19
  Top 0.406: LED1.DIN 16.93,32.35 16.92,32.36 16.92,33.07 R1.2
N$25  (via drill 0.8)
  Top 0.406: R1.1 18.42,36.7 19.5,37.78 v19.5,37.91
  Bottom 0.406: v19.5,37.91 30.17,37.91
  Bottom 0.508: 30.17,37.91 39.7,47.44 45.41,47.44 47.95,49.98 WEMOS1.D4
N$27
  Top 0.406: 13.23,25.42 LED1.DOUT 14.63,27.12 19.5,27.12 22.52,30.13 LED2.DIN
N$28
  Top 0.406: LED2.DOUT 36.25,32.29 LED3.DIN
N$29
  Top 0.406: LED4.DIN 53.87,27.72 42.6,27.72 LED3.DOUT
N$30
  Top 0.406: LED4.DOUT 62.92,29.37 LED5.DIN
N$31
  Top 0.406: LED5.DOUT 70.57,25.85 72.59,25.85 72.59,30.93 71.32,32.2 63.19,32.2 62.46,32.93 LED6.DIN
N$32
  Top 0.406: LED6.DOUT 66.46,40.4 63.49,43.37 58.11,43.37 56.26,41.52 LED7.DIN
N$33
  Top 0.406: LED7.DOUT 49.14,38.12 43.38,43.88 39.95,43.88 38.43,42.36 38.63,42.15 LED8.DIN
N$34
  Top 0.406: LED8.DOUT 40.03,39.82 35.12,39.82 32.15,42.79 LED9.DIN
N$35
  Top 0.406: LED9.DOUT 23.74,39.39 21.41,41.72 21.41,47.18 18.49,50.1 18.52,50.14 LED10.DIN
N$36
  Top 0.406: LED10.DOUT 24.85,53.02 30.73,53.02 32.04,54.34 LED11.DIN
N$37
  Top 0.406: LED11.DOUT 34.54,45.59 38.99,45.59 41.86,48.45 45.58,48.45 LED12.DIN
N$38
  Top 0.406: LED13.DIN 62.65,53.88 60.91,52.14 56.46,52.14 49.09,44.77 45.01,44.77 LED12.DOUT
N$39
  Top 0.406: LED13.DOUT 60.76,48.71 65.73,48.71 68.27,51.25 68.27,59.5 62.18,65.6 60.16,65.6 LED14.DIN
N$40
  Top 0.406: LED14.DOUT 51.81,62.25 47.19,66.87 45.43,66.87 LED15.DIN
N$41
  Top 0.406: LED15.DOUT 40,63.77 36.85,66.92 LED16.DIN
N$42
  Top 0.406: LED16.DOUT 32.57,65.37 32.57,67.82 31.74,68.65 29.54,68.65 26.87,71.31 26.87,73.48 27.83,74.45 31.91,74.45 33.27,75.81 LED17.DIN
N$43
  Top 0.406: LED17.DOUT 29.55,72.41 31.53,70.42 35.12,70.42 36.52,71.82 36.52,75.88 36.9,76.27 41.9,76.27 43.6,77.97 LED18.DIN
N$44
  Top 0.406: LED18.DOUT 41.71,72.84 51.13,72.84 54.43,69.53 61.03,69.53 63.06,71.57 63.06,74.74 61.92,75.88 60.19,75.88 LED19.DIN
N$45
  Top 0.406: LED19.DOUT 58.26,74.55 58.26,76.71 59,77.45 59,83.38 54.78,87.6 LED20.DIN
N$46
  Top 0.406: LED20.DOUT 49.29,84.47 LED21.DIN
N$47
  Top 0.406: LED21.DOUT 43.41,82.69 39.95,86.15 39.95,86.09 38.65,86.09 LED22.DIN
N$48
  Top 0.406: LED22.DOUT 35.65,85.98 35.65,88.14 36.41,88.89 39.75,88.89 40.33,89.47 40.33,91.89 41.47,93.03 43.63,93.03 44.14,93.54 44.14,96.08 46.14,98.08 LED23.DIN
N$49
  Top 0.406: LED23.DOUT 42.14,95.9 44.14,97.9 44.14,107.13 45.97,108.95 LED24.DIN
SCL
  Top 0.508: JP1.1 40.33,58.61 WEMOS1.D1
SDA
  Top 0.508: 43,57.6 JP1.2 43,53.91 WEMOS1.D2